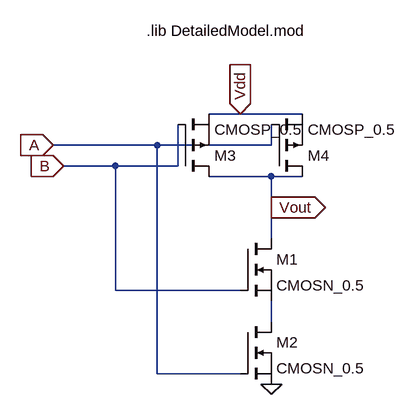
[diagram p0: schematic s_nand.asc]
s_nand.asc, the LTspice schematic file:
Version 4
SHEET 1 880 680
WIRE 128 -224 80 -224
WIRE 224 -224 128 -224
WIRE 0 -176 -160 -176
WIRE 176 -176 176 -208
WIRE 176 -176 0 -176
WIRE -64 -144 -144 -144
WIRE 32 -144 32 -208
WIRE 32 -144 -64 -144
WIRE 176 -128 80 -128
WIRE 224 -128 176 -128
WIRE 176 -80 176 -128
WIRE 176 -32 176 -80
WIRE -64 48 -64 -144
WIRE 128 48 -64 48
WIRE 176 96 176 64
WIRE 0 176 0 -176
WIRE 128 176 0 176
FLAG 176 192 0
IOPIN 176 192 In
FLAG 128 -224 Vdd
IOPIN 128 -224 In
FLAG -160 -176 A
IOPIN -160 -176 In
FLAG -144 -144 B
IOPIN -144 -144 In
FLAG 176 -80 Vout
IOPIN 176 -80 Out
SYMBOL nmos 128 -32 R0
SYMATTR InstName M1
SYMATTR Value CMOSN_0.5
SYMBOL nmos 128 96 R0
SYMATTR InstName M2
SYMATTR Value CMOSN_0.5
SYMBOL pmos 32 -128 M180
SYMATTR InstName M3
SYMATTR Value CMOSP_0.5
SYMBOL pmos 176 -128 M180
SYMATTR InstName M4
SYMATTR Value CMOSP_0.5
TEXT -16 -352 Left 2 !.lib DetailedModel.mod

The netlist it stands for:
* s_nand.asc
M1 Vout B N001 N001 CMOSN_0.5
M2 N001 A 0 0 CMOSN_0.5
M3 Vout B Vdd Vdd CMOSP_0.5
M4 Vout A Vdd Vdd CMOSP_0.5
.model NMOS NMOS
.model PMOS PMOS
.lib standard.mos
.lib DetailedModel.mod
.backanno
.end